# EAGLE schematic avrboard (EAGLE 6.4)
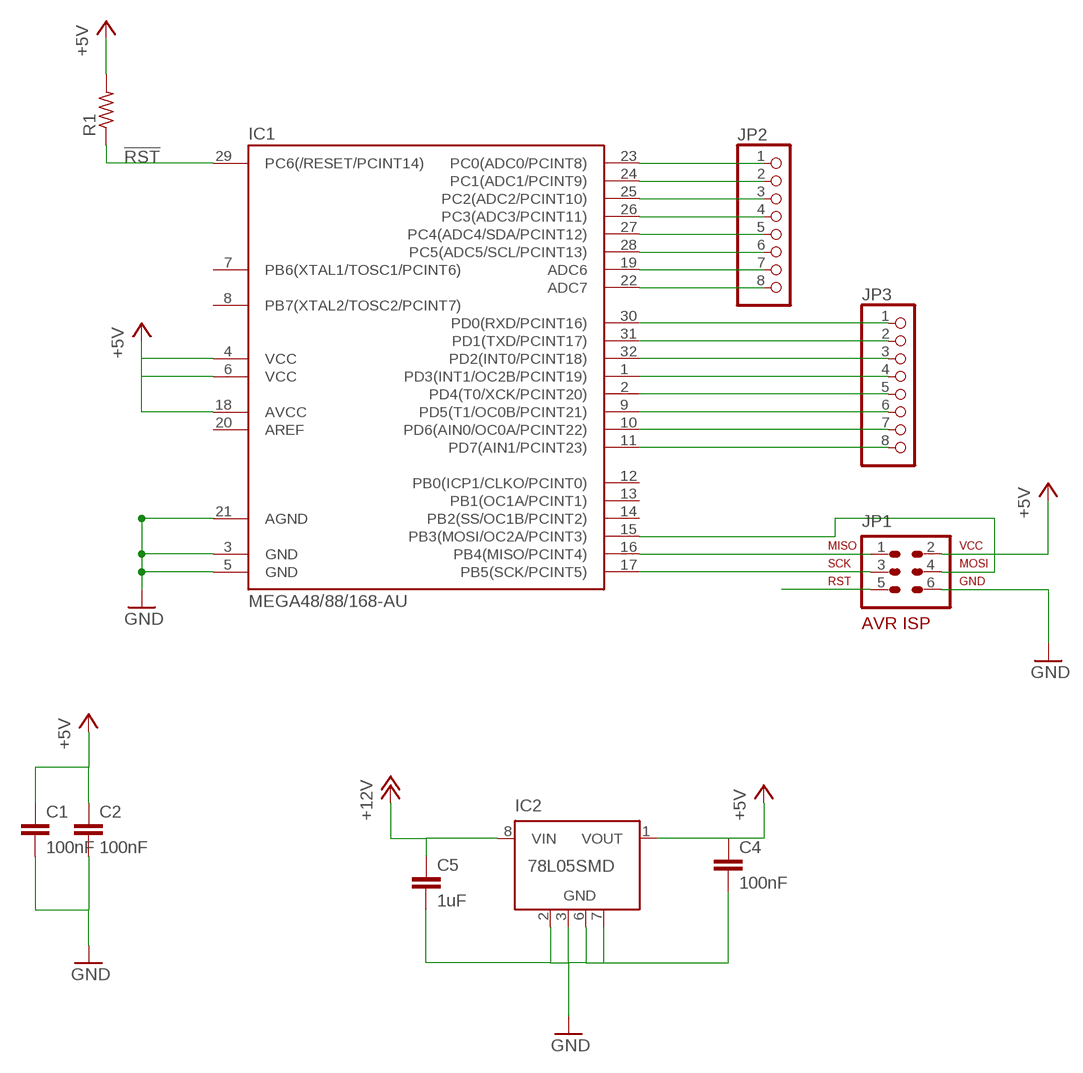
[diagram p0: schematic, sheet 1]

## Parts
C1  100nF  C-EUC0805  [C0805]
C2  100nF  C-EUC0805  [C0805]
C4  100nF  C-EUC0805  [C0805]
C5  1uF  C-EUC0805  [C0805]
IC1  MEGA48/88/168-AU  [TQFP32-08]
IC2  78L05SMD  [SO08]
JP1  AVR-ISP-6VERT  [AVR-ISP-6]
JP2  PINHD-1X8  [1X08]
JP3  PINHD-1X8  [1X08]
R1  R-US_R0805  [R0805]

## Nets
!RST: IC1.29(PC6(/RESET/PCINT14)) JP1.5 R1.1
+5V: C1.1 C2.1 C4.1 IC1.4(VCC) IC1.6(VCC) IC1.18(AVCC) IC2.1(VOUT) JP1.2 R1.2
+12V: C5.1 IC2.8(VIN)
GND: C1.2 C2.2 C4.2 C5.2 IC1.3(GND) IC1.5(GND) IC1.21(AGND) IC2.2(GND) IC2.3(GND) IC2.6(GND) IC2.7(GND) JP1.6
N$2: IC1.23(PC0(ADC0/PCINT8)) JP2.1
N$3: IC1.24(PC1(ADC1/PCINT9)) JP2.2
N$4: IC1.25(PC2(ADC2/PCINT10)) JP2.3
N$5: IC1.26(PC3(ADC3/PCINT11)) JP2.4
N$6: IC1.27(PC4(ADC4/SDA/PCINT12)) JP2.5
N$7: IC1.28(PC5(ADC5/SCL/PCINT13)) JP2.6
N$8: IC1.19(ADC6) JP2.7
N$9: IC1.16(PB4(MISO/PCINT4)) JP1.1
N$10: IC1.17(PB5(SCK/PCINT5)) JP1.3
N$11: IC1.15(PB3(MOSI/OC2A/PCINT3)) JP1.4
N$12: IC1.22(ADC7) JP2.8
N$13: IC1.30(PD0(RXD/PCINT16)) JP3.1
N$14: IC1.31(PD1(TXD/PCINT17)) JP3.2
N$15: IC1.32(PD2(INT0/PCINT18)) JP3.3
N$16: IC1.1(PD3(INT1/OC2B/PCINT19)) JP3.4
N$17: IC1.2(PD4(T0/XCK/PCINT20)) JP3.5
N$18: IC1.9(PD5(T1/OC0B/PCINT21)) JP3.6
N$19: IC1.10(PD6(AIN0/OC0A/PCINT22)) JP3.7
N$20: IC1.11(PD7(AIN1/PCINT23)) JP3.8
Unconnected: IC1.7(PB6(XTAL1/TOSC1/PCINT6)) IC1.8(PB7(XTAL2/TOSC2/PCINT7)) IC1.12(PB0(ICP1/CLKO/PCINT0)) IC1.13(PB1(OC1A/PCINT1)) IC1.14(PB2(SS/OC1B/PCINT2)) IC1.20(AREF) IC2.4(NC) IC2.5(NC)

## Library data of the parts
C1 C2 C4 C5 = rcl:C-EU: CAPACITOR, European symbol
IC1 = avr-7:MEGA48/88/168
IC2 = linear:78L*SMD: Positive VOLTAGE REGULATOR
JP1 = avr-7:AVR-ISP-6: AVR ISP-6 Serial Programming Header
JP2 JP3 = pinhead:PINHD-1X8: PIN HEADER
R1 = resistor:R-US_: RESISTOR, American symbol